# Altium schematic sheet Precharge.SchDoc: Precharge
size 241 x 127 mm; Date: 1/4/2019 10:42:01 PM; SheetNumber: 1; GateName_1: G$1; SymbolName_1: LETTER_L; LibraryName: frames; DeviceSetName: LETTER_L; GateName_2: G$2; SymbolName_2: DOCFIELD
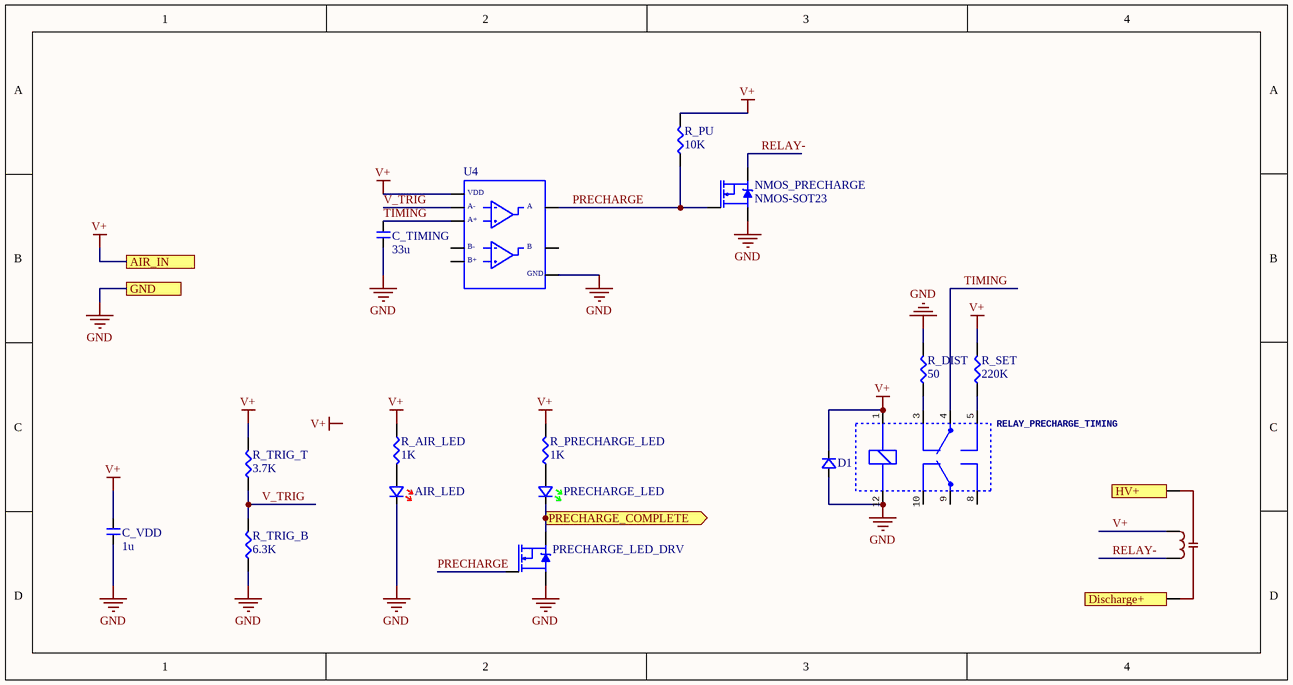
[diagram p0: Precharge.SchDoc]

## Parts
AIR_LED  (no value)  [LEDRED-0603]
C_TIMING  33u  [CAP-0603]
C_VDD  1u  [CAP-0603]
D1  (no value)  [DO41-10]
NMOS_PRECHARGE  NMOS-SOT23  [SOT23]
PRECHARGE_LED  (no value)  [LEDGREEN-0603]
PRECHARGE_LED_DRV  (no value)  [SOT23]
R_AIR_LED  1K  [RES-0603]
R_DIST  50  [AXIAL0.5]
R_PRECHARGE_LED  1K  [RES-0603]
R_PU  10K  [RES-0603]
R_SET  220K  [AXIAL0.5]
R_TRIG_B  6.3K  [RES-0603]
R_TRIG_T  3.7K  [RES-0603]
RELAY_PRECHARGE  COTO9104  [9104-SIP4]  (value not drawn)
RELAY_PRECHARGE_TIMING  (no value)  [RELAY-DPDT_EC2]
U4  (no value)  [SOIC8]

## Ports
AIR_IN, Discharge+, GND, HV+, PRECHARGE_COMPLETE (out)

## Nets
GND: AIR_LED.K C_TIMING.1 C_VDD.1 D1.A NMOS_PRECHARGE.2(S) PRECHARGE_LED_DRV.2(S) R_DIST.2 R_TRIG_B.1 RELAY_PRECHARGE_TIMING.12 U4.4 ; port GND
V+: C_VDD.2 D1.K R_AIR_LED.1 R_PRECHARGE_LED.2 R_PU.2 R_SET.2 R_TRIG_T.2 RELAY_PRECHARGE.3 RELAY_PRECHARGE_TIMING.1 U4.8 ; port AIR_IN
Discharge+: RELAY_PRECHARGE.7 ; port Discharge+
HV+: RELAY_PRECHARGE.1 ; port HV+
PRECHARGE: NMOS_PRECHARGE.1(G) PRECHARGE_LED_DRV.1(G) R_PU.1 U4.1
PRECHARGE_COMPLETE: PRECHARGE_LED.K PRECHARGE_LED_DRV.3(D) ; port PRECHARGE_COMPLETE
RELAY-: NMOS_PRECHARGE.3(D) RELAY_PRECHARGE.5
TIMING: C_TIMING.2 RELAY_PRECHARGE_TIMING.4 U4.3
V_TRIG: R_TRIG_B.2 R_TRIG_T.1 U4.2
NetAIR_LED_A: AIR_LED.A R_AIR_LED.2
NetPRECHARGE_LED_A: PRECHARGE_LED.A R_PRECHARGE_LED.1
NetR_DIST_1: R_DIST.1 RELAY_PRECHARGE_TIMING.3
NetR_SET_1: R_SET.1 RELAY_PRECHARGE_TIMING.5

Not connected (* = marked no-connect by the designer): RELAY_PRECHARGE_TIMING 8 9 10; U4 5 6 7

## Notes on the sheet
- Labels drawn without touching a wire or pin: V+
- Title
- Size:
- Date:
- A
- Number:
- Time:
- Revision:
- Sheet
- of
- File:
- (in symbol IC-SOIC8_LM393) VDD; A-; A; A+; B-; B; B+; GND

## Library data of the parts
AIR_LED = LEDRED-0603
C_TIMING C_VDD = CAP-0603
D1 = DIODE-DO41-10
PRECHARGE_LED = LEDGREEN-0603
PRECHARGE_LED_DRV = NMOS-SOT23
R_AIR_LED R_PRECHARGE_LED R_PU R_TRIG_B R_TRIG_T = RES-0603
R_DIST R_SET = RES-AXIAL0.5
RELAY_PRECHARGE = COTO9104: GateName_1: G$1; SymbolName_1: SPST_REED; LibraryName: Discharge_Components_Altium_Export; DeviceSetName: COTO9104; Package: 9104-SIP4
RELAY_PRECHARGE_TIMING = RELAY_EC2: GateName_1: G$1; SymbolName_1: MONOSTABLERELAY; DeviceSetName: EC2; LibraryName: KEMET; Package: DPDT_2.54
U4 = IC-SOIC8_LM393